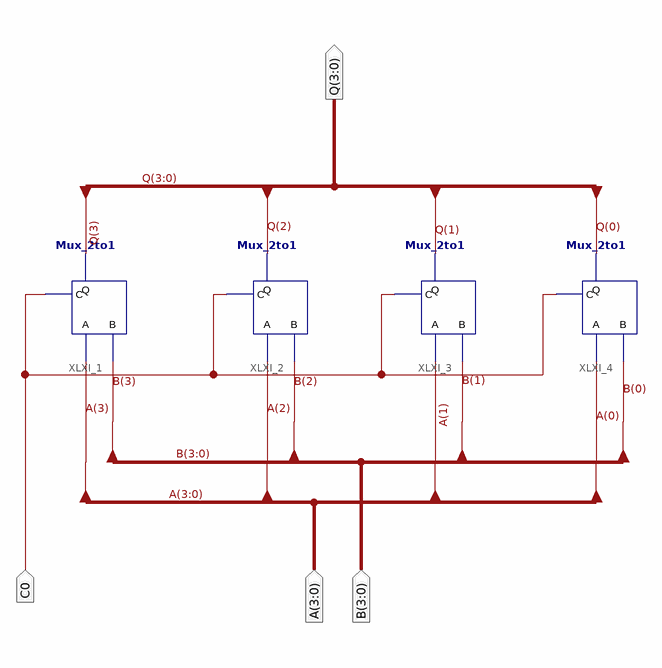
[diagram p0: schematic sheet 1]
// Xilinx ISE schematic Mux_2_4.sch (spartan3e) as structural Verilog: 4 symbols, 4 ports
module Mux_2_4 (
  input  [3:0] A,
  input  [3:0] B,
  input  C0,
  output [3:0] Q
);

  Mux_2to1 XLXI_1 (.A(A[3]), .B(B[3]), .C(C0), .Q(Q[3]));
  Mux_2to1 XLXI_2 (.A(A[2]), .B(B[2]), .C(C0), .Q(Q[2]));
  Mux_2to1 XLXI_3 (.A(A[1]), .B(B[1]), .C(C0), .Q(Q[1]));
  Mux_2to1 XLXI_4 (.A(A[0]), .B(B[0]), .C(C0), .Q(Q[0]));
endmodule
